# EAGLE design pcb_univ_3-9-0-x-rev3 (EAGLE 7.7.0)
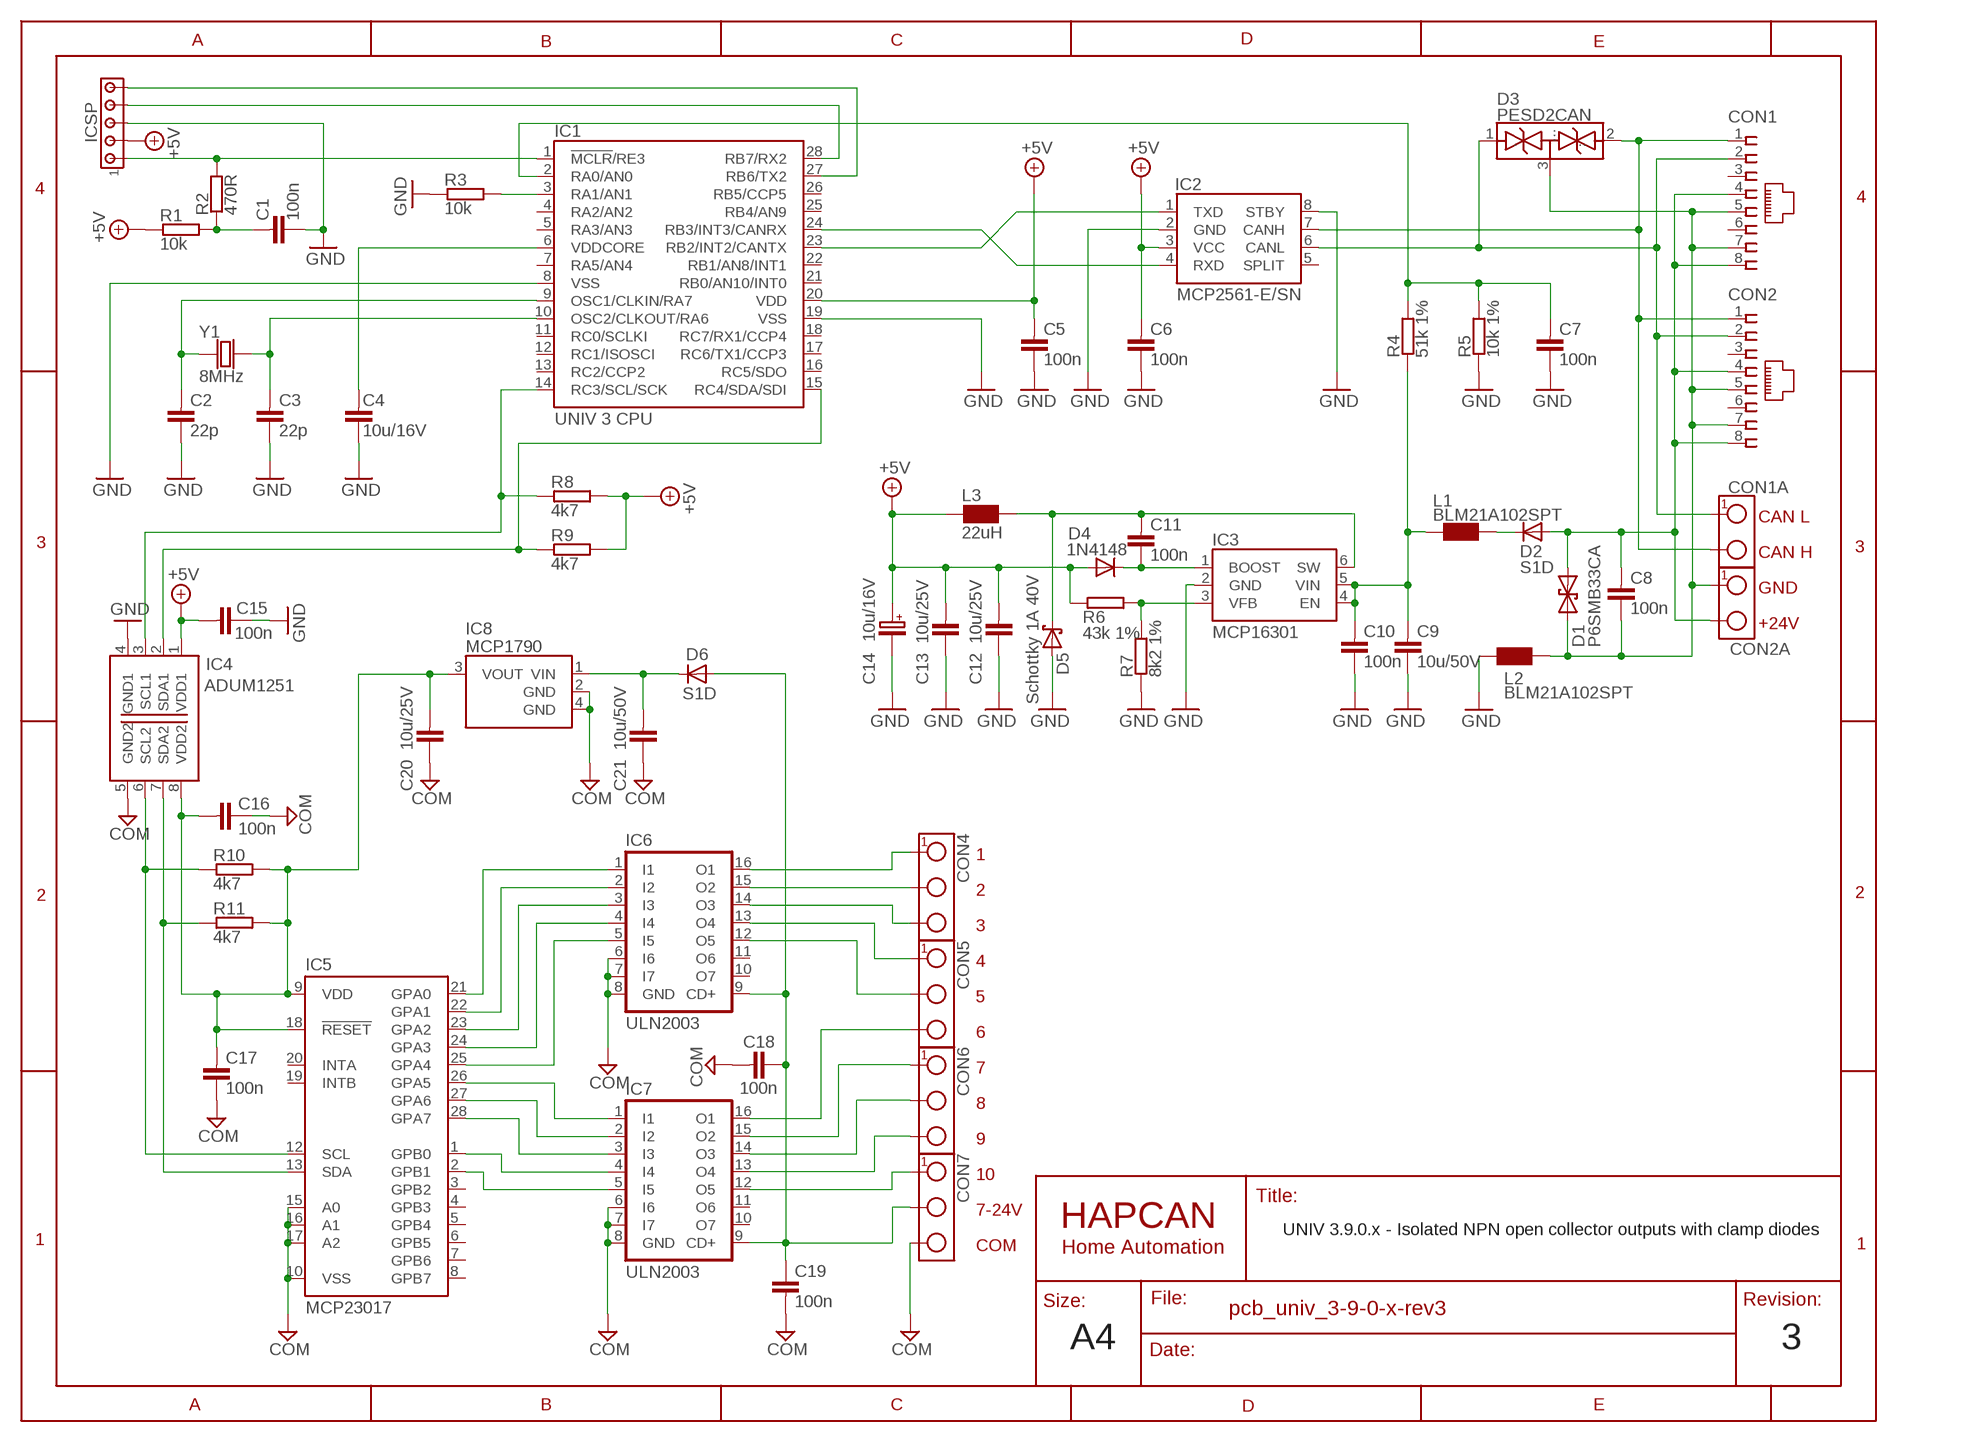
[diagram p0: schematic, sheet 1]
FRAME (HAP_A4): AUTHOR: hapcan.com

## Parts
C1  100n  CAPACITOR0805  [0805]
C2  22p  CAPACITOR0805  [0805]
C3  22p  CAPACITOR0805  [0805]
C4  10u/16V  CAPACITOR0805  [0805]
C5  100n  CAPACITOR0805  [0805]
C6  100n  CAPACITOR0805  [0805]
C7  100n  CAPACITOR0805  [0805]
C8  100n  CAPACITOR0805  [0805]
C9  10u/50V  CAPACITOR1210  [1210]
C10  100n  CAPACITOR0805  [0805]
C11  100n  CAPACITOR0805  [0805]
C12  10u/25V  CAPACITOR1206  [1206]
C13  10u/25V  CAPACITOR1206  [1206]
C14  10u/16V  CAPACITOR-POLARIZED-SMC_B  [SMC_B]
C15  100n  CAPACITOR0805  [0805]
C16  100n  CAPACITOR0805  [0805]
C17  100n  CAPACITOR0805  [0805]
C18  100n  CAPACITOR0805  [0805]
C19  100n  CAPACITOR0805  [0805]
C20  10u/25V  CAPACITOR1206  [1206]
C21  10u/50V  CAPACITOR1210  [1210]
CON1  RJ45-SOCKET  [RJ45-PCB-SOCKET]
CON1A  TERMINAL-2  TERMINAL-2-5X10,5MM  [ARK2-5X10,5MM]
CON2  RJ45-SOCKET  [RJ45-PCB-SOCKET]
CON2A  TERMINAL-2  TERMINAL-2-5X10,5MM  [ARK2-5X10,5MM]
CON4  TERMINAL-3-3.81X8MM  [ARK3-3.81X8MM]
CON5  TERMINAL-3-3.81X8MM  [ARK3-3.81X8MM]
CON6  TERMINAL-3-3.81X8MM  [ARK3-3.81X8MM]
CON7  TERMINAL-3-3.81X8MM  [ARK3-3.81X8MM]
D1  P6SMB33CA  DIODE_TRANSIL2  [DO-214_TRANSIL2]
D2  S1D  DIODE_DO-214  [DO-214]
D3  PESD2CAN  PESD2CANSOT-23  [SOT-23]
D4  1N4148  DIODE_0805  [0805]
D5  Schottky 1A 40V  DIODE_TRANSIL1_DO214  [DO-214]
D6  S1D  DIODE_DO-214  [DO-214]
IC1  UNIV 3 CPU  UNIV3CPU-I/SO  [UNIV3CPU]
IC2  MCP2561-E/SN  [SO-08]
IC3  MCP16301  MCP16301SOT23-6  [SOT-23-6]
IC4  ADUM1251  [SO-08]
IC5  MCP23017  MCP23017-SO  [SO-28W]
IC6  ULN2003  [SO-16]
IC7  ULN2003  [SO-16]
IC8  MCP1790  [SOT-223]
ICSP  HEADER5  [SIP-5]
L1  BLM21A102SPT  CHOKE0805  [0805]
L2  BLM21A102SPT  CHOKE0805  [0805]
L3  22uH  CHOKEDER0705  [CHOKE-DER0705]
R1  10k  RESISTOR0805  [0805]
R2  470R  RESISTOR0805  [0805]
R3  10k  RESISTOR0805  [0805]
R4  51k 1%  RESISTOR0805  [0805]
R5  10k 1%  RESISTOR0805  [0805]
R6  43k 1%  RESISTOR0805  [0805]
R7  8k2 1%  RESISTOR0805  [0805]
R8  4k7  RESISTOR0805  [0805]
R9  4k7  RESISTOR0805  [0805]
R10  4k7  RESISTOR0805  [0805]
R11  4k7  RESISTOR0805  [0805]
Y1  8MHz  CRYSTAL-HC49V  [CRYSTAL-HC49V]

## Nets
+5V: C5.1 C6.1 C12.1 C13.1 C14.+ C15.1 D4.2(A) IC1.20(VDD) IC2.3(VCC) IC4.1(VDD1) ICSP.2 L3.1 R1.1 R6.1 R8.2 R9.2
GND: C1.2 C2.2 C3.2 C4.2 C5.2 C6.2 C7.2 C9.2 C10.2 C12.2 C13.2 C14.- C15.2 D5.A IC1.8(VSS) IC1.19(VSS) IC2.2(GND) IC2.8(STBY) IC3.2(GND) IC4.4(GND1) ICSP.3 L2.1 R3.1 R5.1 R7.1
GND1: C16.2 C17.2 C18.1 C19.1 C20.2 C21.2 CON7.3 IC4.5(GND2) IC5.10(VSS) IC5.15(A0) IC5.16(A1) IC5.17(A2) IC6.6(I6) IC6.7(I7) IC6.8(GND) IC7.6(I6) IC7.7(I7) IC7.8(GND) IC8.2(GND) IC8.4(GND) ; supply symbol labelled COM
N$1: D2.C L1.2
N$2: IC1.24(RB3/INT3/CANRX) IC2.4(RXD)
N$3: IC1.23(RB2/INT2/CANTX) IC2.1(TXD)
N$4: CON1.1 CON1A.2 CON2.1 D3.2(..) IC2.7(CANH)
N$5: C9.1 C10.1 IC3.4(EN) IC3.5(VIN) L1.1 R4.1
N$6: CON4.1 IC6.16(O1)
N$7: C1.1 R1.2 R2.1
N$8: IC1.1(!MCLR!/RE3) ICSP.1 R2.2
N$9: C8.1 CON1.4 CON1.8 CON2.4 CON2.8 CON2A.2 D1.C D2.A
N$10: IC1.28(RB7/RX2) ICSP.4
N$11: CON4.2 IC6.15(O2)
N$12: IC1.3(RA1/AN1) R3.2
N$13: C8.2 CON1.5 CON1.7 CON2.5 CON2.7 CON2A.1 D1.A D3.3(...) L2.2
N$14: IC1.27(RB6/TX2) ICSP.5
N$15: C3.1 IC1.10(OSC2/CLKOUT/RA6) Y1.2
N$16: C7.1 IC1.2(RA0/AN0) R4.2 R5.2
N$17: C11.1 D5.C IC3.6(SW) L3.2
N$18: CON4.3 IC6.14(O3)
N$19: CON5.1 IC6.13(O4)
N$20: IC3.3(VFB) R6.2 R7.2
N$21: CON5.2 IC6.12(O5)
N$22: C16.1 C17.1 C20.1 IC4.8(VDD2) IC5.9(VDD) IC5.18(!RESET) IC8.3(VOUT) R10.2 R11.2
N$24: C21.1 D6.C IC8.1(VIN)
N$25: CON5.3 IC7.16(O1)
N$26: CON6.1 IC7.15(O2)
N$27: CON1.2 CON1A.1 CON2.2 D3.1(.) IC2.6(CANL)
N$28: CON6.3 IC7.13(O4)
N$29: CON7.1 IC7.12(O5)
N$30: CON6.2 IC7.14(O3)
N$33: C18.2 C19.2 CON7.2 D6.A IC6.9(CD+) IC7.9(CD+)
N$37: IC5.21(GPA0) IC6.1(I1)
N$38: C11.2 D4.1(C) IC3.1(BOOST)
N$39: IC5.22(GPA1) IC6.2(I2)
N$40: C2.1 IC1.9(OSC1/CLKIN/RA7) Y1.1
N$41: IC5.23(GPA2) IC6.3(I3)
N$42: IC5.24(GPA3) IC6.4(I4)
N$43: IC5.25(GPA4) IC6.5(I5)
N$46: IC5.26(GPA5) IC7.1(I1)
N$47: IC5.27(GPA6) IC7.2(I2)
N$48: IC5.28(GPA7) IC7.3(I3)
N$49: IC5.1(GPB0) IC7.4(I4)
N$50: IC5.2(GPB1) IC7.5(I5)
N$53: IC4.6(SCL2) IC5.12(SCL) R10.1
N$55: IC4.7(SDA2) IC5.13(SDA) R11.1
N$56: C4.1 IC1.6(VDDCORE)
N$58: IC1.15(RC4/SDA/SDI) IC4.2(SDA1) R9.1
N$59: IC1.14(RC3/SCL/SCK) IC4.3(SCL1) R8.1
Unconnected: CON1.3 CON1.6 CON2.3 CON2.6 IC1.4(RA2/AN2) IC1.5(RA3/AN3) IC1.7(RA5/AN4) IC1.11(RC0/SCLKI) IC1.12(RC1/ISOSCI) IC1.13(RC2/CCP2) IC1.16(RC5/SDO) IC1.17(RC6/TX1/CCP3) IC1.18(RC7/RX1/CCP4) IC1.21(RB0/AN10/INT0) IC1.22(RB1/AN8/INT1) IC1.25(RB4/AN9) IC1.26(RB5/CCP5) IC2.5(SPLIT) IC5.3(GPB2) IC5.4(GPB3) IC5.5(GPB4) IC5.6(GPB5) IC5.7(GPB6) IC5.8(GPB7) IC5.19(INTB) IC5.20(INTA) IC6.10(O7) IC6.11(O6) IC7.10(O7) IC7.11(O6)

## Notes on the sheet
- CAN L
- CAN H
- GND
- +24V
- 1
- 2
- 3
- 4
- 5
- 6
- 7
- 8
- 9
- 10
- 7-24V
- UNIV 3.9.0.x - Isolated NPN open collector outputs with clamp diodes
- COM
- A4 | 3

## Library data of the parts
C1-C13 C15-C21 = HAPCAN_devices - UNIV3:CAPACITOR: HAPCAN Capacitor
C14 = HAPCAN_devices - UNIV3:CAPACITOR-POLARIZED: HAPCAN Polarazied Capacitor
CON1 CON2 = HAPCAN_devices - UNIV3:RJ45-SOCKET: HAPCAN RJ45 socket
CON1A CON2A = HAPCAN_devices - UNIV3:TERMINAL-2: HAPCAN Terminal Block - 2 way
CON4-CON7 = HAPCAN_devices - UNIV3:TERMINAL-3: HAPCAN Terminal Block - 3 way
D1 = HAPCAN_devices - UNIV3:DIODE_TRANSIL2: HAPCAN Bidirectional transil diode
D2 D4 D6 = HAPCAN_devices - UNIV3:DIODE: HAPCAN Rectifier Diode
D3 = HAPCAN_devices - UNIV3:PESD2CAN: CAN bus ESD protection diode
D5 = HAPCAN_devices - UNIV3:DIODE_TRANSIL1: HAPCAN Unidirectional transil diode
IC1 = HAPCAN_devices - UNIV3:UNIV3CPU: HAPCAN Microcontroller UNIV 3 CPU
IC2 = HAPCAN_devices - UNIV3:MCP2561: HAPCAN CAN Tranceiver
IC3 = HAPCAN_devices - UNIV3:MCP16301: High Voltage Input Integrated Switch Step-Down Regulator
IC4 = HAPCAN_devices - UNIV3:ADUM1251: Hot Swappable, Dual I2C Isolator
IC5 = HAPCAN_devices - UNIV3:MCP23017: 16-Bit I/O Expander with Serial Interface
IC6 IC7 = HAPCAN_devices - UNIV3:ULN2003: HAPCAN 7 channel Darlington Array NPN 50V 0.5A
IC8 = HAPCAN_devices - UNIV3:MCP1790: 70 mA, High Voltage Regulator
ICSP = HAPCAN_devices - UNIV3:HEADER5: HAPCAN Header 5
L1-L3 = HAPCAN_devices - UNIV3:CHOKE: Choke
R1-R11 = HAPCAN_devices - UNIV3:RESISTOR: HAPCAN Resistor
Y1 = HAPCAN_devices - UNIV3:CRYSTAL: HAPCAN Crystal

## Board
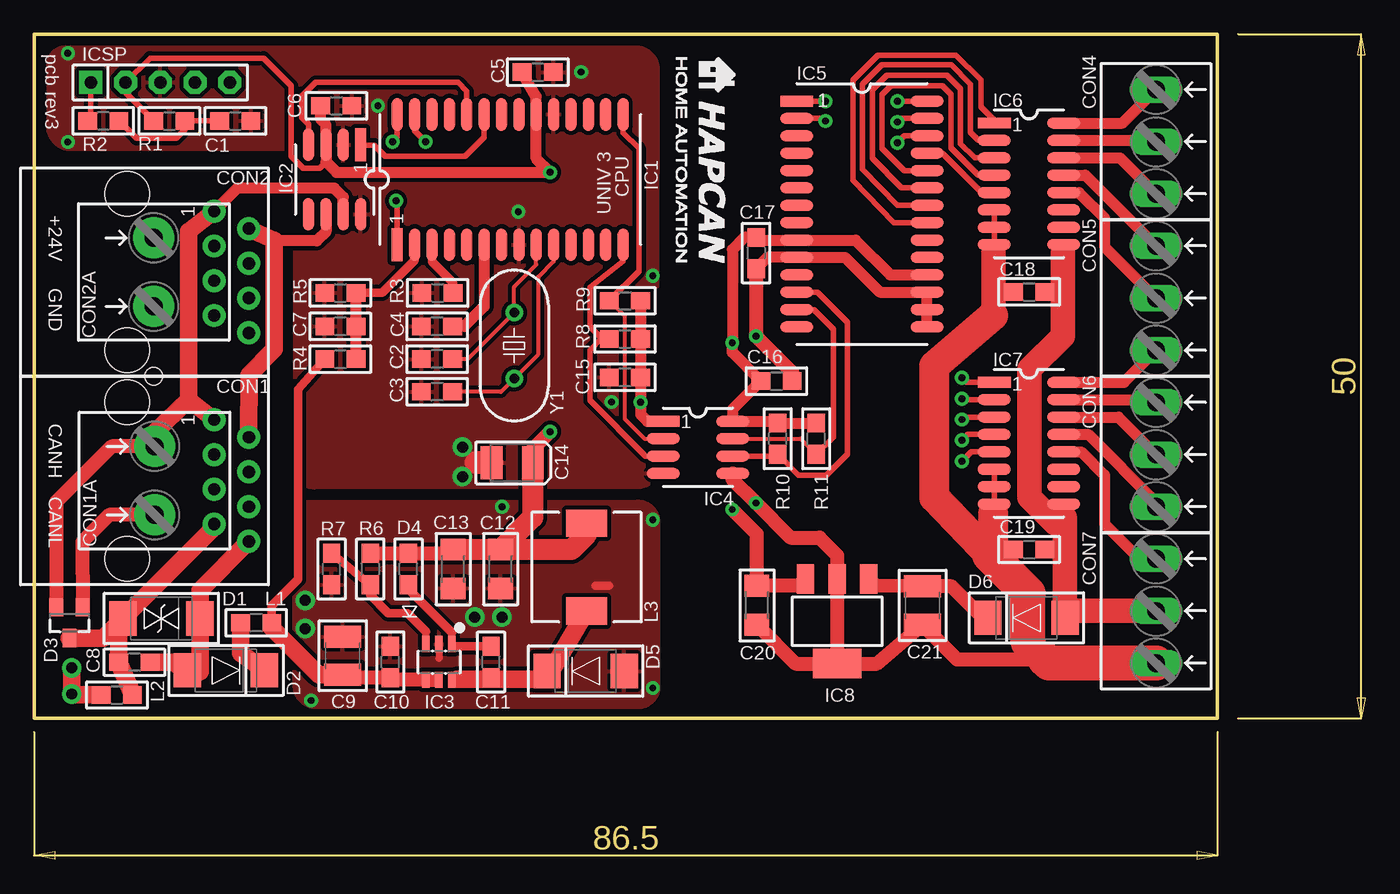
[diagram p1: board, top side]
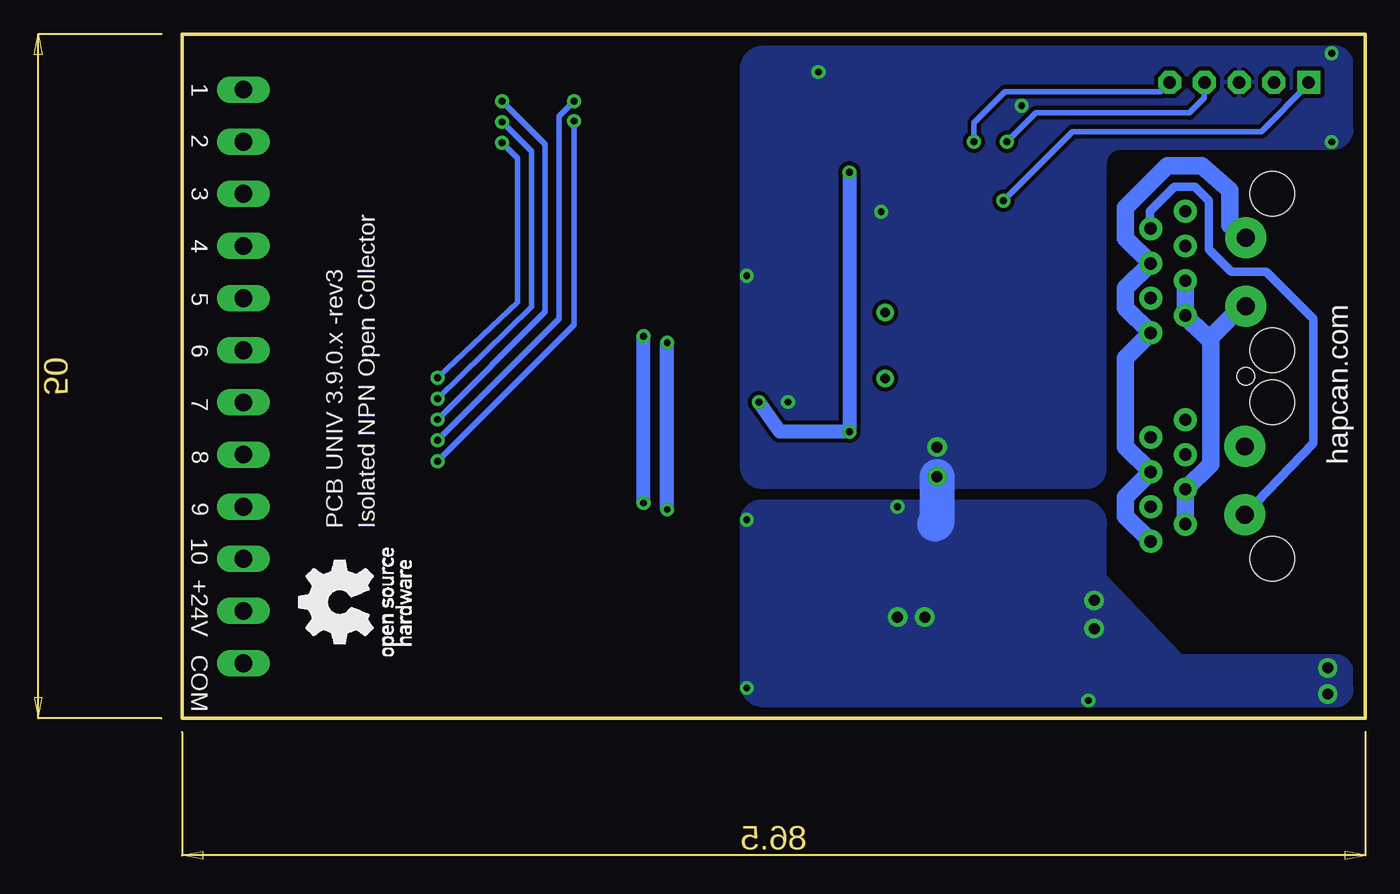
[diagram p2: board, bottom side, seen from below]

Size 86.5 x 50 mm. Coordinates in mm from the lower left corner, seen from the top.
Outline: 0,50 0,0 86.5,0 86.5,50 0,50
Copper layers (1*16): Top 0.035mm / dielectric 1.5mm / Bottom 0.035mm
Design rules "HAPCAN-Drc": minimum track width 10mil, minimum drill 0.5mm, track to track 12mil, track to pad 12mil, pad to pad 12mil, via to via 12mil, smd to smd 10mil, copper to edge 20mil, drill to drill 8mil, minimum pad ring 10mil, minimum via ring 10mil, stop-mask expansion 4mil, vias tented up to drill 0mil, thermal gap 10mil
Holes 1.3 mm at 8.74,25
tKeepout: 20 lines

### Footprints (pad centres in the part's own frame; a part is rotated, then mirrored left to right if it is on the bottom)
0805 = smd 1.372 x 1.27: 1 -1.143,0; 2 1.143,0
1210 = smd 1.6 x 2.7: 1 -1.4,0; 2 1.4,0
1206 = smd 1.6 x 1.803: 1 -1.422,0; 2 1.422,0
SMC_B = smd 1.6 x 2.4: + -1.5,0; - 1.5,0
RJ45-PCB-SOCKET = drill 0.9 pad 1.676: 1 -4.445,6.35; 2 -3.175,8.89; 3 -1.905,6.35; 4 -0.635,8.89; 5 0.635,6.35; 6 1.905,8.89; 7 3.175,6.35; 8 4.445,8.89 | hole 3.251: -5.715,0; 5.715,0
ARK2-5X10,5MM = drill 1.3 pad 3: 1 -2.5,0; 2 2.5,0
ARK3-3.81X8MM = drill 1.3 pad 1.8 long: 1 -3.81,0; 2 0,0; 3 3.81,0
DO-214_TRANSIL2 = smd 2 x 2.5: A 2.82,0; C -2.82,0
DO-214 = smd 2 x 2.5: A 2.82,0; C -2.82,0
SOT-23 = smd 1.016 x 1.321: 1 -0.965,-1.118; 2 0.965,-1.118; 3 0,1.118
UNIV3CPU = smd 2.4 x 0.8: 1 -4.763,8.255; 2 -4.763,6.985; 3 -4.763,5.715; 4 -4.763,4.445; 5 -4.763,3.175; 6 -4.763,1.905; 7 -4.763,0.635; 8 -4.763,-0.635; 9 -4.763,-1.905; 10 -4.763,-3.175; 11 -4.763,-4.445; 12 -4.763,-5.715; 13 -4.763,-6.985; 14 -4.763,-8.255; 15 4.763,-8.255; 16 4.763,-6.985; 17 4.763,-5.715; 18 4.763,-4.445; 19 4.763,-3.175; 20 4.763,-1.905; 21 4.763,-0.635; 22 4.763,0.635; 23 4.763,1.905; 24 4.763,3.175; 25 4.763,4.445; 26 4.763,5.715; 27 4.763,6.985; 28 4.763,8.255
SO-08 = smd 2.4 x 0.8: 1 -2.54,1.905; 2 -2.54,0.635; 3 -2.54,-0.635; 4 -2.54,-1.905; 5 2.54,-1.905; 6 2.54,-0.635; 7 2.54,0.635; 8 2.54,1.905
SOT-23-6 = smd 0.55 x 1.2: 1 -0.95,-1.3; 2 0,-1.3; 3 0.95,-1.3; 4 0.95,1.3; 5 0.003,1.3; 6 -0.95,1.3
SO-28W = smd 2.4 x 0.8: 1 -4.763,8.255; 2 -4.763,6.985; 3 -4.763,5.715; 4 -4.763,4.445; 5 -4.763,3.175; 6 -4.763,1.905; 7 -4.763,0.635; 8 -4.763,-0.635; 9 -4.763,-1.905; 10 -4.763,-3.175; 11 -4.763,-4.445; 12 -4.763,-5.715; 13 -4.763,-6.985; 14 -4.763,-8.255; 15 4.763,-8.255; 16 4.763,-6.985; 17 4.763,-5.715; 18 4.763,-4.445; 19 4.763,-3.175; 20 4.763,-1.905; 21 4.763,-0.635; 22 4.763,0.635; 23 4.763,1.905; 24 4.763,3.175; 25 4.763,4.445; 26 4.763,5.715; 27 4.763,6.985; 28 4.763,8.255
SO-16 = smd 2.4 x 0.8: 1 -2.54,4.445; 2 -2.54,3.175; 3 -2.54,1.905; 4 -2.54,0.635; 5 -2.54,-0.635; 6 -2.54,-1.905; 7 -2.54,-3.175; 8 -2.54,-4.445; 9 2.54,-4.445; 10 2.54,-3.175; 11 2.54,-1.905; 12 2.54,-0.635; 13 2.54,0.635; 14 2.54,1.905; 15 2.54,3.175; 16 2.54,4.445
SOT-223 = smd 1.27 x 2.159: 1 -2.311,-3.099; 2 0,-3.099; 3 2.311,-3.099 | smd 3.556 x 2.159: 4 0,3.099
SIP-5 = drill 0.9 pad 1.676 square: 1 -5.08,0 | drill 0.9 pad 1.676 octagon: 2 -2.54,0; 3 0,0; 4 2.54,0; 5 5.08,0
CHOKE-DER0705 = smd 2 x 3: 1 -3.2,0; 2 3.2,0
CRYSTAL-HC49V = drill 0.7 pad 1.27: 1 -2.413,0; 2 2.413,0

### Placement (x,y rotation side)
C1  14.71,43.66 0 top
C2  29.45,26.26 180 top
C3  29.45,23.87 180 top
C4  29.45,28.65 180 top
C5  36.81,47.23 0 top
C6  22.09,44.77 0 top
C7  22.39,28.65 180 top
C8  7.33,4.11 180 top
C9  22.56,4.58 90 top
C10  26.03,4.13 90 top
C11  33.4,4.13 90 top
C12  34.09,10.92 270 top
C13  30.63,10.92 270 top
C14  34.94,18.69 180 top
C15  43.18,24.92 180 top
C16  54.26,24.65 0 top
C17  52.77,34 270 top
C18  72.72,31.18 0 top
C19  72.72,12.35 0 top
C20  52.83,8.26 270 top
C21  64.94,8.26 270 top
CON1  6.8,17.38 270 top
CON1A  8.8,17.38 90 top
CON2  6.8,32.62 270 top
CON2A  8.74,32.62 90 top
CON4  82,42.15 270 top
CON5  82,30.71 270 top
CON6  82,19.29 270 top
CON7  82,7.86 270 top
D1  9.3,7.3 180 top
D2  14.02,3.52 180 top
D3  2.58,7 180 top
D4  27.35,10.92 90 top
D5  40.31,3.47 0 top
D6  72.53,7.35 0 top
IC1  34.8,39.38 90 top
IC2  21.96,39.38 270 top
IC3  29.59,4.13 180 top
IC4  48.51,19.81 0 top
IC5  60.5,36.86 0 top
IC6  72.72,39.07 0 top
IC7  72.72,20.12 0 top
IC8  58.69,7.1 180 top
ICSP  9.22,46.48 0 top
L1  16.23,7 180 top
L2  6.05,1.72 0 top
L3  40.36,11.06 270 top
R1  9.88,43.66 0 top
R2  5.05,43.66 180 top
R3  29.48,31.09 0 top
R4  22.39,26.26 0 top
R5  22.39,31.09 0 top
R6  24.56,10.92 270 top
R7  21.74,10.92 90 top
R8  43.18,27.73 0 top
R9  43.18,30.52 0 top
R10  54.35,20.45 90 top
R11  57.16,20.45 90 top
Y1  35.09,27.25 270 top

### Tracks (layer width: path | path; a pad name or v marks a point on that pad's centre or on a via)
+5V  (via drill 0.5)
  Top 0.406: 21.32,40.68 20.86,40.21 19.66,40.21 18.8,41.07 18.8,46.23 16.76,48.26 8.46,48.26 ICSP.2 6.68,45.72 R1.1
  Top 0.813: C5.1 36.7,45.43 IC1.20 36.7,40.92 v37.72,39.9 34.31,39.9 22.1,39.9 21.32,40.68 IC2.3 21.32,43.37 20.94,43.75 C6.1 | R9.2 R8.2 C15.1 v44.32,23.11 44.32,22.23 44.83,21.72 IC4.1
  Top 1.016: R6.1 D4.2 30.35,12.06 arc90 C13.1 | 36.58,18.82 C14.+ 36.45,19.68 v37.72,20.95
  Top 1.422: L3.1 40.36,13.44
  Top 1.524: C12.1 C13.1 | 40.36,13.44 39.27,12.34 C12.1 | C14.+ 36.45,14.7 C12.1
  Bottom 1.016: v37.72,39.9 v37.72,20.95 42.8,20.95 v44.32,23.11
GND  (via drill 0.5, 0.8 pad 1.42)
  Top 0.406: C1.2 15.85,43.51
  Top 0.508: IC3.2 29.59,4.38
  Top 0.61: 43.31,3.14 D5.A | 41.02,9.72 42.04,9.72
  Top 1.27: v2.74,3.69 v2.74,1.79 2.92,1.72 L2.1
  Top 1.676: C14.- 32.33,18.69
  Bottom 2.54: v31.3,17.67 31.3,14.42 arc90 31.5,14.22
  other vias: 19.81,6.57 32.21,7.4 19.81,8.62 39.96,47.24 35.39,37.03 25.12,44.78 31.3,19.83 2.46,48.6 2.46,42.13 34.19,7.4 34.2,15.46 45.22,14.52 20.25,1.31 42.2,23.12 45.22,32.35 45.22,2.23
  pour Top (isolate 0.305): 44.07,15.85 arc-90 45.59,14.46 45.59,2.6 arc-90 44.39,0.83 20.7,0.83 arc-90 19.05,2.31 19.05,15.85
  pour Top: 43.93,49.02 2.25,49.02 arc90 1.02,47.75 1.02,43.51 arc90 2.52,41.62 19.05,41.62 19.05,18.09 arc90 20.61,16.92 44.17,16.92 arc90 45.59,18.43 45.09,19.09 45.03,31.6 45.57,31.6 45.57,32.08 45.59,47.46 arc90
  pour Bottom: 1.02,3.52 arc-90 2.29,4.53 13.46,4.53 19.05,10.38 19.05,14.04 arc-90 20.39,15.84 44.07,15.84 arc-90 45.59,14.44 45.59,2.5 arc-90 43.94,0.98 2.03,0.98 arc-90 1.02,2.25
  pour Bottom: 45.59,47.46 45.59,18.5 arc-90 44.17,16.94 20.6,16.94 arc-90 19.05,18.07 19.05,40.6 arc90 17.78,41.71 2.29,41.71 arc-90 1.02,43.14 1.02,48.01 arc-90 2.54,49.02 43.94,49.02 arc-90
GND1  (via drill 0.5)
  Top 0.406: C18.1 70.1,30.99 | IC6.6 IC6.7 IC6.8 arc-15 70.1,34.04 | IC7.6 IC7.7 IC7.8 70.18,15.32 70.1,14.99
  Top 0.813: C17.2 53.59,33.69 IC5.10 59.28,33.69 61.82,31.15 IC5.17 IC5.16 IC5.15 | 70.61,12.19 70.36,11.94 69.85,11.94
  Top 1.016: C19.1 70.77,12.35 70.61,12.19 | C17.2 52.76,32.85 v52.76,27.94 55.41,25.29 C16.2 | 73.91,4.32 67.46,4.32 C21.2 61.59,4 IC8.4 | C20.2 55.66,4 IC8.4 | IC8.4 IC8.2 58.69,11.92 57.4,13.21 55.3,13.21 v52.76,15.75 51.05,17.45 IC4.5
  Top 1.778: 70.1,29.46 70.1,30.99 70.1,34.04 | 73.91,4.32 72.64,5.59
  Top 2.184: 70.1,29.46 65.79,25.76 65.79,16.15 70.1,11.68 70.1,14.99
  Top 2.54: CON7.3 74.19,4.04 73.91,4.32 | 72.64,5.59 72.64,9.14 70.1,11.68 69.85,11.94
  Bottom 1.016: v52.76,15.75 v52.76,27.94
N$1
  Top 1.27: L1.2 15.09,4.76 D2.C
N$2
  Top 0.406: IC2.4 20.05,43.42 19.54,43.94 19.54,45.46 20.56,46.48 30.97,46.48 31.62,45.83 IC1.24
N$3
  Top 0.406: IC1.23 32.89,42.48 31.5,41.09 25.66,41.09 24.85,41.9 23.88,41.9 IC2.1
N$4
  Top 0.813: IC2.7 22.59,38.09 21.93,38.75 14.84,38.75 CON2.1
  Top 1.016: CON1A.2 5.67,19.88 1.63,15.84 D3.2
  Top 1.27: 11.3,23.29 CON1.1 | 11.3,23.29 11.3,35.6 CON2.1 | 11.3,23.29 8.8,20.92 CON1A.2
N$5
  Top 0.305: 29.3,2.83 IC3.5
  Top 0.61: R4.1 19.3,24.06 19.3,10.16 17.37,8.23 L1.1 17.27,7.1
  Top 1.016: C10.1 26.11,2.9 | 22.73,3.01 C9.1 22.75,2.98 C10.1 | C10.1 26.19,2.83 IC3.4 29.3,2.83
  Top 1.27: L1.1 17.37,6.62 20.81,3.19 C9.1
N$6
  Top 0.813: IC6.16 79.56,43.51 CON4.1
N$7
  Top 0.305: 11.02,43.04 R1.2
  Top 0.406: R2.1 7.48,42.38 10.36,42.38 11.02,43.04 | R1.2 C1.1
N$8  (via drill 0.5)
  Top 0.406: ICSP.1 4.14,43.89 R2.2 | IC1.1 26.54,37.75 v26.45,37.84
  Bottom 0.406: ICSP.1 4.14,46.37 7.62,42.89 21.4,42.89 v26.45,37.84
N$9
  Top 1.27: CON1.8 12.12,9.36 D1.C 12.12,3.42 D2.A 10.1,4.11 C8.1
  Bottom 1.27: CON1.8 17.53,14.77 17.53,16.18 CON1.4 17.53,19.85 17.53,26.34 CON2.8 17.53,30.01 17.53,31.42 CON2.4 17.53,35.09 17.53,37.32 14.48,40.37 11.94,40.37 9.91,38.59 9.91,36.03 CON2A.2
N$10  (via drill 0.5)
  Top 0.406: IC1.28 26.54,42.48 v26.2,42.13
  Bottom 0.406: ICSP.4 11.76,45.35 12.87,44.25 24.08,44.25 v26.2,42.13
N$11
  Top 0.813: IC6.15 81.9,42.24 CON4.2
N$12
  Top 0.61: IC1.3 29.08,33.37 30.62,31.83 R3.2
N$13
  Top 1.27: D3.3 5.05,5.88 D1.A | D1.A 6.19,7.01 C8.2 L2.2 | CON1.7 13.15,13.97 D1.A
  Bottom 1.016: 11.43,27.73 11.3,27.65 | 13.15,29.37 CON2.7
  Bottom 1.27: CON2A.1 9.25,29.91 11.43,27.73 | CON2.7 CON2.5 | 13.15,29.37 11.3,27.65 11.3,18.59 CON1.5 CON1.7
N$14  (via drill 0.5)
  Top 0.406: IC1.27 27.81,42.93 v28.61,42.13
  Bottom 0.406: ICSP.5 14.97,45.81 26.33,45.81 28.61,43.53 v28.61,42.13
N$15
  Top 0.305: C3.1 34.12,23.87 Y1.2 36.81,26.56 36.81,32.25 37.97,33.41 IC1.10
N$16
  Top 0.305: R4.2 23.44,28.81
  Top 0.61: IC1.2 27.81,33.47 25.43,31.09 R5.2
  Top 0.813: R4.2 C7.1 R5.2
N$17
  Top 0.508: 30.91,2.86 30.57,2.86 IC3.6
  Top 0.61: 33.2,2.96 C11.1 | D5.C 37.13,3.31
  Top 1.27: L3.2 37.49,2.96 D5.C 37.08,2.86 33.3,2.86 33.2,2.96 | C11.1 33.27,2.86 30.91,2.86
N$18
  Top 0.813: IC6.14 79.36,40.97 CON4.3
N$19
  Top 0.813: IC6.13 76.82,39.7 CON5.1
N$20
  Top 0.508: IC3.3 28.64,6.35
  Top 0.61: 28.64,6.35 27.3,7.68 25.88,7.68 24.56,9.03 R6.2 R7.2
N$21
  Top 0.813: IC6.12 76.38,38.43 78.23,36.58 78.23,34.48 CON5.2
N$22  (via drill 0.5)
  Top 0.813: R11.2 R10.2 54.22,21.72 IC4.8 51.05,22.61 53.1,24.65 | IC5.18 62.58,32.42 60.04,34.96 IC5.9 52.96,34.96 C17.1 51.91,35.15 51.03,34.27 v51.03,27.46 51.03,26.74 C16.1
  Top 1.016: IC8.3 55.86,9.68 C20.1 52.83,10.42 52.83,13.46 v51.03,15.27 | C16.1 53.1,24.65
  Bottom 1.016: v51.03,15.27 v51.03,27.46
N$24
  Top 1.016: D6.C 69.36,7.35 67.06,9.65 64.97,9.65 C21.1 61.52,9.68 IC8.1
N$25
  Top 0.813: IC7.16 79.66,24.56 CON5.3
N$26
  Top 0.813: IC7.15 81.8,23.29 CON6.1
N$27
  Top 0.813: IC2.6 21.32,35.56 20.66,34.89 17.79,34.89 CON2.2
  Top 1.016: D3.1 3.53,12.91 5.5,14.88 CON1A.1
  Top 1.27: CON2.2 17.53,34.96 17.53,26.96 15.7,25.13 CON1.2
  Bottom 0.61: CON1A.1 3.81,20.13 3.81,29.2 7.24,32.62 9.78,32.62 11.43,34.28 11.43,37.83 12.45,38.85 13.97,38.85 15.75,37.07 15.75,35.85 CON2.2
N$28
  Top 0.813: IC7.13 77.04,20.75 82,15.79 CON6.3
N$29
  Top 0.813: IC7.12 76.53,19.48 78.23,17.78 78.23,14.22 80.79,11.66 CON7.1
N$30
  Top 0.813: IC7.14 79.26,22.02 CON6.2
N$33
  Top 0.406: 75.18,34.04 75.26,34.11 IC6.9 | 75.21,15.16 IC7.9 | C18.2 75.18,30.99
  Top 0.813: C19.2 74.02,12.19 75.35,12.19
  Top 1.016: 75.21,14.81 75.21,15.16
  Top 1.778: CON7.2 75.86,7.86 D6.A 75.35,12.19 75.35,14.22 | 75.18,34.04 75.18,30.99 75.18,27.94 72.75,25.5 72.75,16.15 74.68,14.22 75.35,14.22 | 75.35,14.22 75.35,14.67 75.21,14.81
N$37
  Top 0.406: IC5.21 62.83,36.23 59.84,39.32 59.84,46.63 61.67,48.46 67.39,48.46 69.19,46.66 69.19,44.7 70.18,43.71 IC6.1
N$38
  Top 0.508: IC3.1 30.54,6.25
  Top 0.61: IC3.1 30.7,5.27 C11.2 | 30.54,6.25 27.35,9.44 D4.1
N$39
  Top 0.406: IC6.2 69.01,42.24 68.43,42.82 68.43,46.33 67.06,47.75 61.98,47.75 60.55,46.33 60.55,40.13 63.09,37.5 IC5.22
N$40
  Top 0.305: C2.1 31.68,26.26 Y1.1 35.09,31.54 36.7,33.16 IC1.9
N$41
  Top 0.406: IC6.3 68.76,40.97 67.72,42.01 67.72,46 66.7,47.02 62.33,47.02 61.27,45.95 61.27,40.92 63.39,38.77 IC5.23
N$42
  Top 0.406: IC6.4 69.01,39.7 67,41.71 67,45.62 66.4,46.23 62.61,46.23 61.98,45.59 61.98,41.66 63.59,40.04 IC5.24
N$43
  Top 0.406: IC5.25 66.39,41.31 69.27,38.43 IC6.5
N$46  (via drill 0.5)
  Top 0.406: IC5.26 63.61,42.58 v63.09,42.06 | v67.82,24.89 68.15,24.56 IC7.1
  Bottom 0.406: v67.82,24.89 61.98,30.4 61.98,40.95 v63.09,42.06
N$47  (via drill 0.5)
  Top 0.406: IC5.27 63.35,43.85 v63.09,43.59 | v67.82,23.37 67.89,23.29 IC7.2
  Bottom 0.406: v67.82,23.37 60.96,30.07 60.96,41.45 v63.09,43.59
N$48  (via drill 0.5)
  Top 0.406: IC5.28 v63.1,45.12 arc90 v63.09,45.11 | v67.82,21.84 68,22.02 IC7.3
  Bottom 0.406: v67.82,21.84 59.94,29.72 59.94,41.96 v63.09,45.11
N$49  (via drill 0.5)
  Top 0.406: IC5.1 v57.83,45.12 v57.84,45.11 | v67.82,20.32 68.25,20.75 IC7.4
  Bottom 0.406: 67.56,20.32 v67.82,20.32 58.93,29.21 58.93,44.02 v57.84,45.11
N$50  (via drill 0.5)
  Top 0.406: IC5.2 57.65,43.85 v57.84,43.66 | v67.82,18.8 68.5,19.48 IC7.5
  Bottom 0.406: v67.82,18.8 57.84,28.78 v57.84,43.66
N$53
  Top 0.406: IC5.12 57.24,31.15 59.44,28.96 59.44,19.3 57.91,17.78 55.87,17.78 R10.1 54.22,19.18 IC4.6
N$55
  Top 0.305: IC4.7 56.02,20.45 R11.1
  Top 0.406: IC5.13 56.99,29.88 58.42,28.45 58.42,20.56 R11.1
N$56
  Top 0.813: IC1.6 32.89,30.11 31.43,28.65 C4.1
N$58
  Top 0.305: IC4.2 44.6,20.45 43.18,21.87 43.18,29.38 R9.1
  Top 0.406: IC1.15 43.05,42.8 44.2,41.66 44.2,32.68 R9.1
N$59
  Top 0.406: IC1.14 43.05,33.4 40.64,31.5 40.64,28.62 41.45,27.81 41.45,27.73 | R8.1 41.45,27.73 | IC4.3 44.7,19.18 40.64,23.24 40.64,26.92 41.45,27.73

### Text on the board
tPlace: pcb rev3 | +24V | GND | CANH | CANL
bPlace: 1 | 2 | 3 | 4 | 5 | 6 | 7 | 8 | hapcan.com | 9 | Isolated NPN Open Collector | PCB UNIV 3.9.0.x -rev3 | 10 | +24V | COM